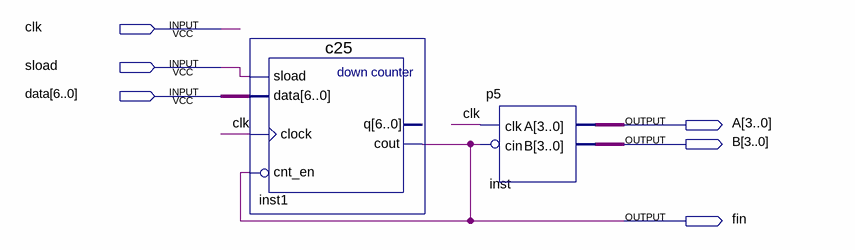
[diagram p0: schematic sheet]
// Quartus schematic p6.bdf as structural Verilog: 2 symbols, 6 pins
module p6 (
  input  clk,
  input  sload,
  input  [6:0] data,
  output [3:0] A,
  output [3:0] B,
  output fin
);

  c25 inst1 (.clock(clk), .cnt_en(~fin), .data(data), .sload(sload), .cout(fin));  // open: q
  p5 inst (.cin(~fin), .clk(clk), .A(A), .B(B));
endmodule
